# Altium schematic sheet Sheet1.SchDoc: ддд
size 594 x 420 mm; ApprovedBy: Саченков В.; CompanyName: АО "Завод ПРОТОН"; DrawnBy: 11; Engineer: 11; Organization: 11; Address1: 11; Address2: 11; Address3: 11; Address4: 11; DocumentNumber: 11; Revision: 111; SheetNumber: 1; SheetTotal: 2; #NAME?: 11; ImagePath: 11; Application_BuildNumber: 11
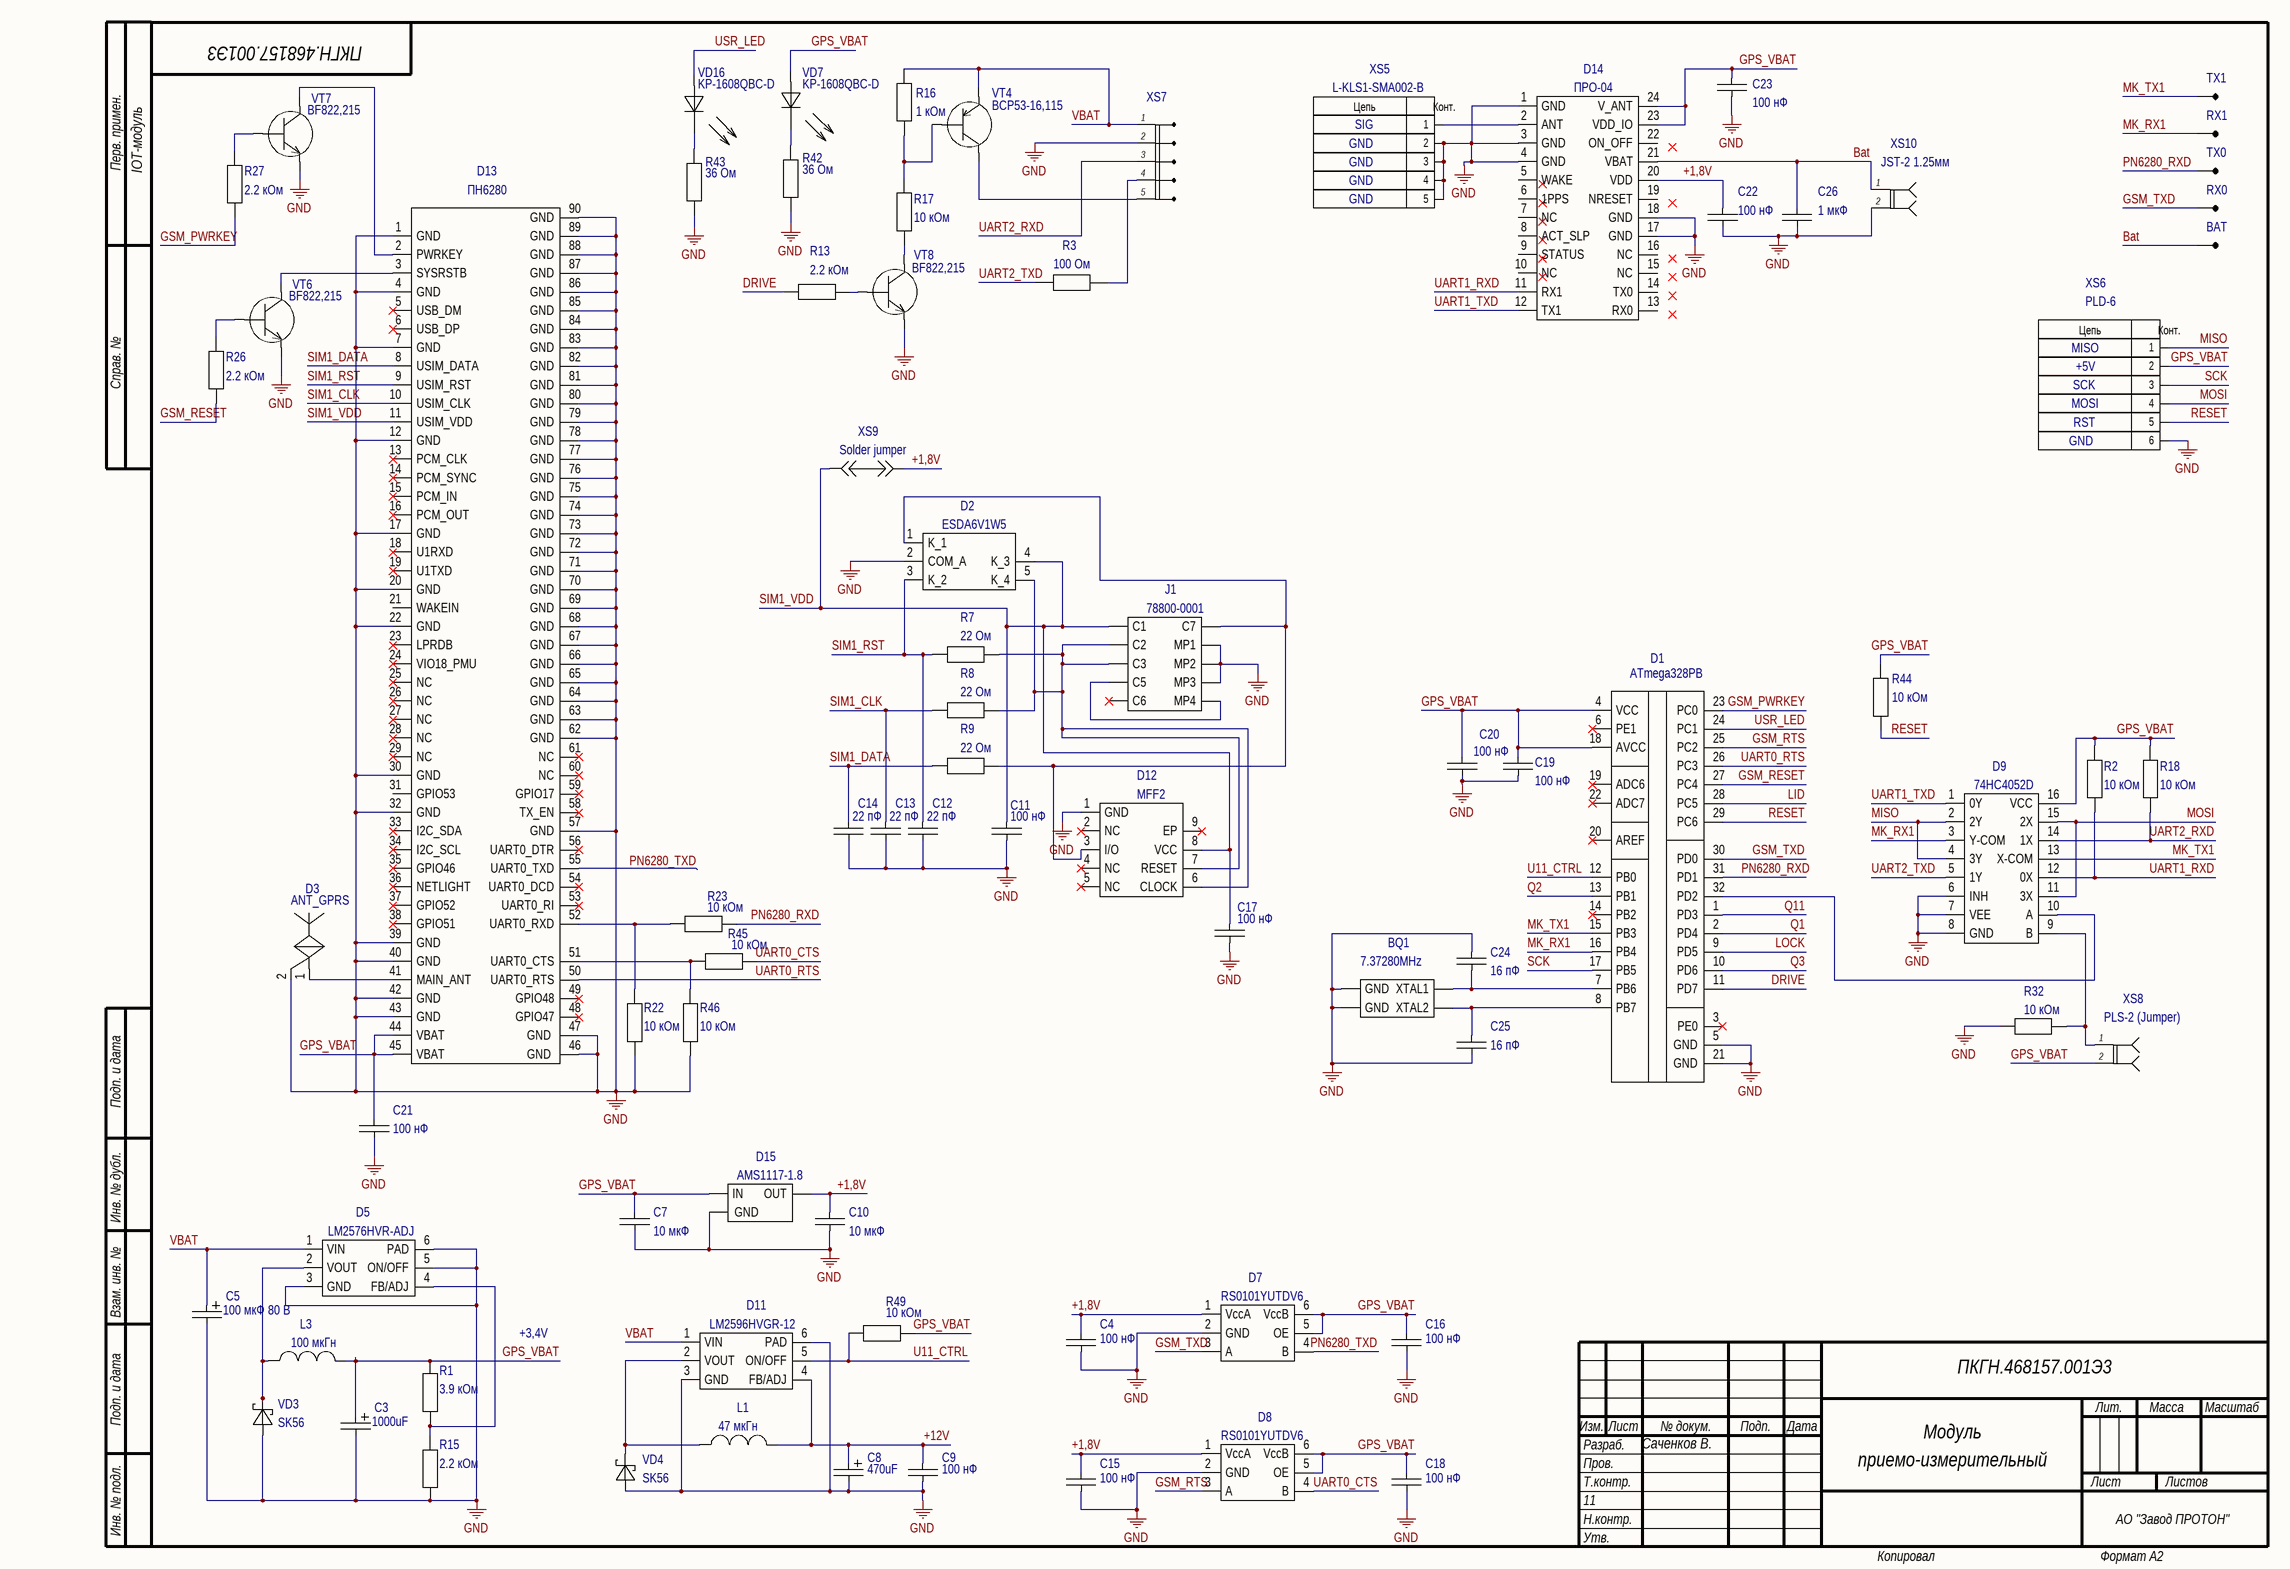
[diagram p0: Sheet1.SchDoc]

## Parts
BAT  Pad  [PAD]  (value not drawn)
BQ1  7.37280MHz  [XTALL_KX-13]
C3  1000uF  [CP_SMD_BD10.0-L10.3_W10.3-LS11.0]
C4  100 нФ  [C_0603_(1608)]
C5  100 мкФ 80 В  [CP_D12.5_H13.5]
C7  10 мкФ  [C_0603_(1608)]
C8  470uF  [CP_SMD_BD10.0-L10.3_W10.3-LS11.0]
C9  100 нФ  [C_0603_(1608)]
C10  10 мкФ  [C_0603_(1608)]
C11  100 нФ  [C_0603_(1608)]
C12  22 пФ  [C_0603_(1608)]
C13  22 пФ  [C_0603_(1608)]
C14  22 пФ  [C_0603_(1608)]
C15  100 нФ  [C_0603_(1608)]
C16  100 нФ  [C_0603_(1608)]
C17  100 нФ  [C_0603_(1608)]
C18  100 нФ  [C_0603_(1608)]
C19  100 нФ  [C_0603_(1608)]
C20  100 нФ  [C_0603_(1608)]
C21  100 нФ  [C_0603_(1608)]
C22  100 нФ  [C_0603_(1608)]
C23  100 нФ  [C_0603_(1608)]
C24  16 пФ  [C_0603_(1608)]
C25  16 пФ  [C_0603_(1608)]
C26  1 мкФ  [С_0805_(2012)]
D1  ATmega328PB  [QFP80P900X900X120-32N]
D2  ESDA6V1W5  [SOT65P210X110-5N]
D3  ANT_GPRS  [ANT_GPRS]
D5  LM2576HVR-ADJ  [TO-263-5]
D7  RS0101YUTDV6  [DFN1.54x1.0-6L]
D8  RS0101YUTDV6  [DFN1.54x1.0-6L]
D9  74HC4052D  [SOIC127P600X175-16N]
D11  LM2596HVGR-12  [TO-263-5]
D12  MFF2  [SON127P600X500X90-9N-D]
D13  ПН6280  [ПН6280]
D14  ПРО-04  [PRO-04_SMD]
D15  AMS1117-1.8  [SOT-223(BCE)]
J1  78800-0001
L1  47 мкГн  [B82477G4]
L3  100 мкГн  [Inductor_SMD]
R1  3.9 кОм  [R_0603_(1608)]
R2  10 кОм  [R_0603_(1608)]
R3  100 Ом  [R_0603_(1608)]
R7  22 Ом  [R_0603_(1608)]
R8  22 Ом  [R_0603_(1608)]
R9  22 Ом  [R_0603_(1608)]
R13  2.2 кОм  [R_0603_(1608)]
R15  2.2 кОм  [R_0603_(1608)]
R16  1 кОм  [R_0603_(1608)]
R17  10 кОм  [R_0603_(1608)]
R18  10 кОм  [R_0603_(1608)]
R22  10 кОм  [R_0603_(1608)]
R23  10 кОм  [R_0603_(1608)]
R26  2.2 кОм  [R_0603_(1608)]
R27  2.2 кОм  [R_0603_(1608)]
R32  10 кОм  [R_0603_(1608)]
R42  36 Ом  [R_0603_(1608)]
R43  36 Ом  [R_0603_(1608)]
R44  10 кОм  [R_0603_(1608)]
R45  10 кОм  [R_0603_(1608)]
R46  10 кОм  [R_0603_(1608)]
R49  10 кОм  [R_0603_(1608)]
RX0  Pad  [PAD]  (value not drawn)
RX1  Pad  [PAD]  (value not drawn)
TX0  Pad  [PAD]  (value not drawn)
TX1  Pad  [PAD]  (value not drawn)
VD3  SK56  [DIONM5236X261N]
VD4  SK56  [DIONM5236X261N]
VD7  KP-1608QBC-D  [KP1608QBCD]
VD16  KP-1608QBC-D  [KP1608QBCD]
VT4  BCP53-16,115  [SOT-223(BCE)]
VT6  BF822,215  [SOT23-3]
VT7  BF822,215  [SOT23-3]
VT8  BF822,215  [SOT23-3]
XS5  L-KLS1-SMA002-B  [LKLS1SMA002B]
XS6  PLD-6  [PLD-6]
XS7  Pad 1x5  [PLS-5(NO_3D)]  (value not drawn)
XS8  PLS-2 (Jumper)  [PLS-2]
XS9  Solder jumper  [Solder_Jumper]
XS10  JST-2 1.25мм  [JST-2_1.25]

## Nets
GND: BQ1.2(GND) BQ1.4(GND) C3.2 C4.1 C5.2 C7.2 C8.2 C9.1 C10.2 C11.1 C12.1 C13.1 C14.1 C15.1 C16.1 C17.1 C18.1 C19.1 C20.1 C21.1 C22.1 C23.1 C24.2 C25.1 C26.1 D1.5(GND) D1.21(GND) D2.2(COM_A) D3.2(GND) D5.3(GND) D5.5(ON/OFF) D5.6(PAD) D7.2(GND) D8.2(GND) D9.6(INH) D9.7(VEE) D9.8(GND) D11.3(GND) D11.6(PAD) D12.1(GND) D13.1(GND) D13.4(GND) D13.7(GND) D13.12(GND) D13.17(GND) D13.20(GND) D13.22(GND) D13.30(GND) D13.32(GND) D13.39(GND) D13.40(GND) D13.42(GND) D13.43(GND) D13.46(GND) D13.47(GND) D13.57(GND) D13.62(GND) D13.63(GND) D13.64(GND) D13.65(GND) D13.66(GND) D13.67(GND) D13.68(GND) D13.69(GND) D13.70(GND) D13.71(GND) D13.72(GND) D13.73(GND) D13.74(GND) D13.75(GND) D13.76(GND) D13.77(GND) D13.78(GND) D13.79(GND) D13.80(GND) D13.81(GND) D13.82(GND) D13.83(GND) D13.84(GND) D13.85(GND) D13.86(GND) D13.87(GND) D13.88(GND) D13.89(GND) D13.90(GND) D14.1(GND) D14.3(GND) D14.4(GND) D14.17(GND) D14.18(GND) D15.1(GND) J1.MP1 J1.MP2 J1.MP3 R15.1 R22.1 R32.2 R42.1 R43.1 R46.1 VD3.2 VD4.2 VT6.2(E) VT7.2(E) VT8.2(E) XS5.2 XS5.3 XS5.4 XS5.5 XS6.6 XS7.2 XS10.2
+1,8V: C4.2 C10.1 C15.2 C22.2 D7.1(VccA) D8.1(VccA) D14.20(VDD) D15.2(OUT) XS9.2
+12V: C8.1 C9.2 D11.4(FB/ADJ) L1.2
Bat: BAT.1 C26.2 D14.21(VBAT) XS10.1
DRIVE: D1.11(PD7) R13.1
GPS_VBAT: C3.1 C7.1 C16.2 C18.2 C19.2 C20.2 C21.2 C23.2 D1.4(VCC) D1.18(AVCC) D7.5(OE) D7.6(VccB) D8.5(OE) D8.6(VccB) D9.16(VCC) D13.44(VBAT) D13.45(VBAT) D14.23(VDD_IO) D14.24(V_ANT) D15.3(IN) L3.2 R1.2 R2.2 R18.2 R44.1 R49.1 VD7.1(A) XS6.2 XS8.2
GSM_PWRKEY: D1.23(PC0) R27.1
GSM_RESET: D1.27(PC4) R26.1
GSM_RTS: D1.25(PC2) D8.3(A)
GSM_TXD: D1.30(PD0) D7.3(A) RX0.1
LID: D1.28(PC5)
LOCK: D1.9(PD5)
MISO: D9.2(2Y) D9.4(3Y) XS6.1
MK_RX1: D1.16(PB4) D9.3(Y-COM) RX1.1
MK_TX1: D1.15(PB3) D9.13(X-COM) TX1.1
MOSI: D9.11(3X) D9.15(2X) XS6.4
PN6280_RXD: D1.31(PD1) R23.1 TX0.1
PN6280_TXD: D7.4(B) D13.55(UART0_TXD)
Q1: D1.2(PD4)
Q2: D1.13(PB1)
Q3: D1.10(PD6)
Q11: D1.1(PD3)
RESET: D1.29(PC6) R44.2 XS6.5
SCK: D1.17(PB5) XS6.3
SIM1_CLK: C13.2 D13.10(USIM_CLK) R8.2
SIM1_DATA: C14.2 D13.8(USIM_DATA) R9.2
SIM1_RST: C12.2 D2.3(K_2) D13.9(USIM_RST) R7.2
SIM1_VDD: C11.2 C17.2 D2.4(K_3) D12.8(VCC) D13.11(USIM_VDD) J1.C1 XS9.1
U11_CTRL: D1.12(PB0) D11.5(ON/OFF) R49.2
UART0_CTS: D8.4(B) R45.1
UART0_RTS: D1.26(PC3) D13.50(UART0_RTS)
UART1_RXD: D9.12(0X) D14.11(RX1) R2.1
UART1_TXD: D9.1(0Y) D14.12(TX1)
UART2_RXD: D9.14(1X) R18.1 XS7.3
UART2_TXD: D9.5(1Y) R3.1
USR_LED: D1.24(PC1) VD16.1(A)
VBAT: C5.1 D5.1(VIN) D11.1(VIN) R16.2 VT4.3(E) XS7.1
NetBQ1_1: BQ1.1(XTAL1) C24.1 D1.7(PB6)
NetBQ1_3: BQ1.3(XTAL2) C25.2 D1.8(PB7)
NetD1_32: D1.32(PD2) D9.10(A)
NetD2_1: D2.1(K_1) D12.3(I/O) J1.C7 R9.1
NetD2_5: D2.5(K_4) D12.6(CLOCK) D12.7(RESET) J1.C2 J1.C3 R7.1 R8.1
NetD3_1: D3.1(NET) D13.41(MAIN_ANT)
NetD5_2: D5.2(VOUT) L3.1 VD3.1
NetD5_4: D5.4(FB/ADJ) R1.1 R15.2
NetD9_9: D9.9(B) R32.1 XS8.1
NetD11_2: D11.2(VOUT) L1.1 VD4.1
NetD13_2: D13.2(PWRKEY) VT7.3(C)
NetD13_3: D13.3(SYSRSTB) VT6.3(C)
NetD13_51: D13.51(UART0_CTS) R45.2 R46.2
NetD13_52: D13.52(UART0_RXD) R22.2 R23.2
NetD14_2: D14.2(ANT) XS5.1
NetJ1_C5: J1.C5 J1.MP4
NetR3_2: R3.2 XS7.4
NetR13_2: R13.2 VT8.1(B)
NetR16_1: R16.1 R17.2 VT4.1(B)
NetR17_1: R17.1 VT8.3(C)
NetR26_2: R26.2 VT6.1(B)
NetR27_2: R27.2 VT7.1(B)
NetR42_2: R42.2 VD7.2(C)
NetR43_2: R43.2 VD16.2(C)
NetVT4_2: VT4.2(C) XS7.5

Not connected (* = marked no-connect by the designer): D1 3(PE0)* 6(PE1)* 14(PB2)* 19(ADC6)* 20(AREF)* 22(ADC7)*; D12 2(NC)* 4(NC)* 5(NC)* 9(EP)*; D13 5(USB_DM)* 6(USB_DP)* 13(PCM_CLK)* 14(PCM_SYNC)* 15(PCM_IN)* 16(PCM_OUT)* 18(U1RXD)* 19(U1TXD)* 21(WAKEIN) 23(LPRDB)* 24(VIO18_PMU)* 25(NC)* 26(NC)* 27(NC)* 28(NC)* 29(NC)* 31(GPIO53) 33(I2C_SDA)* 34(I2C_SCL)* 35(GPIO46)* 36(NETLIGHT)* 37(GPIO52)* 38(GPIO51)* 48(GPIO47)* 49(GPIO48)* 53(UART0_RI)* 54(UART0_DCD)* 56(UART0_DTR)* 58(TX_EN)* 59(GPIO17)* 60(NC)* 61(NC)*; D14 5(WAKE) 6(1PPS) 7(NC) 8(ACT_SLP) 9(STATUS) 10(NC) 13(RX0) 14(TX0) 15(NC) 16(NC) 19(NRESET) 22(ON_OFF); J1 C6*

## Notes on the sheet
- ПКГН.468157.001Э3
- IOT-модуль
- SIG
- GND
- MISO
- +5V
- SCK
- RST
- MOSI
- +3,4V
- Модуль
- Саченков В.
- приемо-измерительный
- Перв. примен.
- Справ. №
- Подп. и дата
- Инв. № дубл.
- Взам. инв. №
- Разраб.
- Изм.
- Лист
- № докум.
- Подп.
- Дата
- Лит.
- Масса
- Масштаб
- Пров.
- Т.контр.
- Листов
- Инв. № подл.
- Утв.
- Н.контр.
- Копировал
- Формат А2
- (in symbol PLS_5) Цепь; Конт.
- (in symbol PLS_6) Цепь; Конт.

## Library data of the parts
BQ1 = XTALL_KX-13: https://www.elitan.ru/price/item348176; Type: Кварцевый резонатор; Package: SMD KX-13
C3 = CapPol: Type: Конденесатор электролит.; U max: 10 В; tolerance: 20%; Package: SMD 10x10.5мм
C4 C9 C11 C15-C23 = Cap: Type: Керамич. чип-конденсатор; smd size: 0603; tolerance: 10%; U max: 16 В; Component kind: X7R
  C16: Parameter 1: *; Parameter 2: *
C5 = CapPol: Type: Конденесатор электролит.; U max: 80 В; tolerance: 20%; Package: SMD 12.5x13.5mm
C7 C10 = C: https://www.chipdip.ru/product/grm188r60j106me47d?utm_source=direct&utm_medium=cpc&position_type=premium%7Ck50id%7C010000002888725_2888725%7Ccid%7C78738975%7Cgid%7C5038974208%7Caid%7C12817036899%7Csrc%7Csearch_none&utm_campaign=Y_dinamika_site&utm_content=text1_ya&utm_term=&_openstat=ZGlyZWN0LnlhbmRleC5ydTs3ODczODk3NTsxMjgxNzAzNjg5OTt5YW5kZXgucnU6cHJlbWl1bQ&yclid=7086227334585909247; Type: Керамич. чип-конденсатор; smd size: 0603; tolerance: 20%; U max: 6.3 В; Copmonent kind: X5R; Parameter 1: *; Parameter 2: *
C8 = CapPol: Type: Конденесатор электролит.; U max: 25 В; tolerance: 20%; Package: SMD 10x10.5мм
C12-C14 C24 C25 = Cap: Type: Керамич. чип-конденсатор; smd size: 0603; tolerance: 5%; U max: 50 В; Component kind: NP0
C26 = Cap: Type: Керамич. чип-конденсатор; smd size: 0805; tolerance: 10%; U max: 16В; Component kind: X7R
D1 = ATmega328PB: Type: Микроконтроллер; Package: [TQFP-32]
D2 = ESDA6V1W5: Type: Диодная сборка; Package: [SOT-323-5]
D3 = ANT_GPRS: PCB_ant; Type: *
D5 = LM2576HVR-ADJ: Type: Импульсный DC/DC преобразователь; Package: [D2PAK-5/TO-263-5]
D7 D8 = RS0101YUTDV6: https://www.chipdip.ru/product0/8011065169 / https://datasheet.lcsc.com/lcsc/2111190930_Jiangsu-RUNIC-Tech-RS0101YUTDV6_C2921397.pdf; Type: Преобразователь уровней; Package: [DFN1.45x1.0-6L]
D9 = 74HC4052D: Type: Мультиплексор; Package: [SO-16]
D11 = LM2596HVGR-12: Type: Импульсный DC/DC преобразователь; Package: [TO-263-5L]
D13 = ПН6280: Type: 2G/3G модуль
D14 = PRO-04: Type: Навигационный модуль
D15 = AMS1117-3.3: https://www.chipdip.ru/product/ams1117-1.8; Type: Линейный стабилизатор напряжения; Package: [SOT-223]
J1 = 78800: Type: Разъем для карты памяти
L1 L3 = Inductor: Type: Катушка индуктивности SMD
  L1: Package: B82477G4
  L3: Package: SWRB1205S-101MT
R1-R3 R7-R9 R13 R15-R18 R22 R23 R26 R27 R32 R42-R46 R49 = R: Power dissipation: 0.1 Вт; smd size: 0603; tolerance: 5%; Type: Керамич. чип-резистор
VD3 VD4 = Schottky: https://www.chipdip.ru/product/sk56; Type: Диод Шоттки; U max: 5 A, 60 В; Package: [SMB]
VD7 VD16 = LED: Type: Чип-светодиод; smd size: 0603
VT4 = TRANS-PNP: https://www.chipdip.ru/product/bcp53-16-nxp; Type: Тр-р биполярный PNP; Power dissipation: 1.3 Вт; U max: 80 В, 1А; Package: [SOT-223]
VT6-VT8 = TRANS-NPN: https://www.chipdip.ru/product/bf822-215; Type: Тр-р биполярный NPN; Power dissipation: 0.25 Вт; U max: 250 В, 50 мА; Package: [SOT-23-3]
XS5 = PLS_5: https://www.chipdip.ru/product/kls1-sma002-b-sma-jr; Type: ВЧ разъем SMA угловой
XS6 = PLS_6: Type: Вилка штыревая 2.54мм 2х3 прямая тип1
XS8 = XS2: Type: Вилка штыревая 2.54мм 1х2 прямая тип1
XS9 = Jumper_2: Type: Вилка штыревая прямая тип-1; Package: PLS-2
XS10 = XS2: https://www.chipdip.ru/product0/9000808758; Type: Разъём питания
D12 = MFF2: Type: *; Package: *